# EAGLE design LED Weather Display (EAGLE 9.1.3)
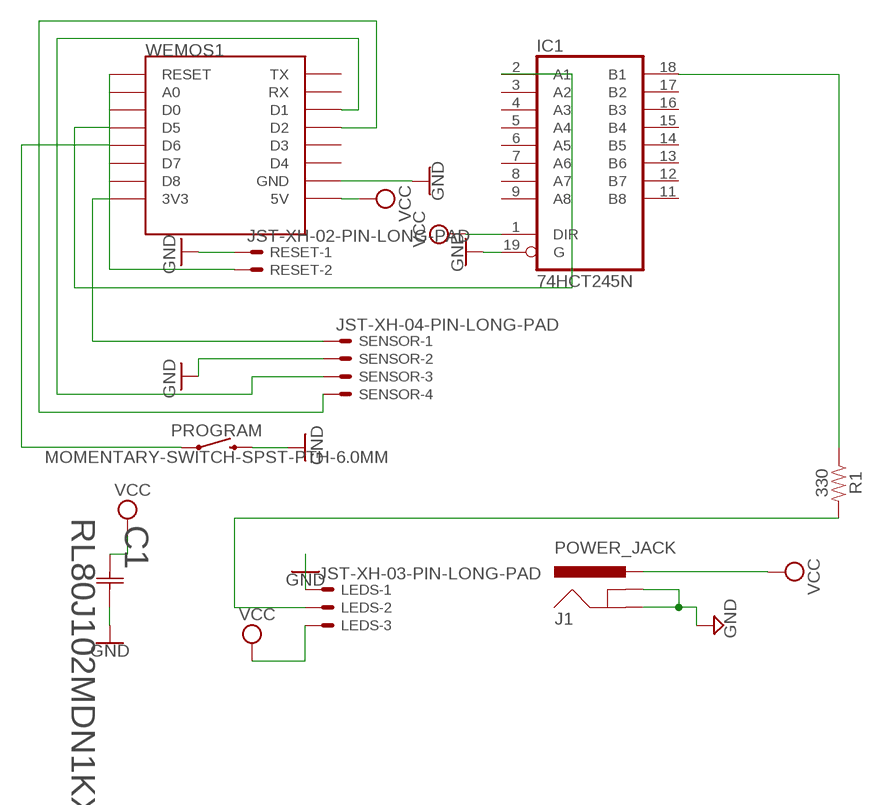
[diagram p0: schematic, sheet 1]

## Parts
C1  RL80J102MDN1KX  [RL8]
IC1  74HCT245N  [DIL20]
J1  POWER_JACK  [POWER_JACK_PTH]
LEDS  JST-XH-03-PIN-LONG-PAD  [JST-XH-03-PACKAGE-LONG-PAD]
PROGRAM  MOMENTARY-SWITCH-SPST-PTH-6.0MM  [TACTILE_SWITCH_PTH_6.0MM]
R1  330  330OHM-HORIZ-1/10W-5%  [AXIAL-0.3]
RESET  JST-XH-02-PIN-LONG-PAD  [JST-XH-02-PACKAGE-LONG-PAD]
SENSOR  JST-XH-04-PIN-LONG-PAD  [JST-XH-04-PACKAGE-LONG-PAD]
WEMOS1  WEMOS-D1-MINI  [WEMOS-D1-MINI]

## Nets
GND: C1.2 IC1.19(G) J1.GND J1.GNDBREAK LEDS.1 PROGRAM.3 RESET.1 SENSOR.2 WEMOS1.GND
N$1: SENSOR.1 WEMOS1.3V3
N$2: LEDS.2 R1.P$2
N$3: IC1.2(A1) WEMOS1.D5
N$4: IC1.18(B1) R1.P$1
N$5: SENSOR.3 WEMOS1.D1
N$6: SENSOR.4 WEMOS1.D2
N$7: PROGRAM.1 WEMOS1.D6
N$8: RESET.2 WEMOS1.RESET
VCC: C1.1 IC1.1(DIR) J1.PWR LEDS.3 WEMOS1.5V
Unconnected: IC1.3(A2) IC1.4(A3) IC1.5(A4) IC1.6(A5) IC1.7(A6) IC1.8(A7) IC1.9(A8) IC1.11(B8) IC1.12(B7) IC1.13(B6) IC1.14(B5) IC1.15(B4) IC1.16(B3) IC1.17(B2) WEMOS1.A0 WEMOS1.D0 WEMOS1.D3 WEMOS1.D4 WEMOS1.D7 WEMOS1.D8 WEMOS1.RX WEMOS1.TX

## Power pins joined to a net without a drawn wire
GND: IC1.10(GND)
VCC: IC1.20(VCC)

## Library data of the parts
C1 = Kyle's Custom:RL80J102MDN1KX: Ceramic Capacitor; MANUFACTURER_PART_NUMBER: RL80J102MDN1KX; VENDOR: Nichicon
IC1 = 74xx-eu:74*245: Octal BUS TRANSCEIVER, 3-state
J1 = SparkFun-Connectors:POWER_JACK: Power Jack Connector This is the standard 5.5mm barrel jack for power. The PTH is the most common, proven, reliable, footprint. The Slot footprint only works if the mill layer is transmitted to the PCB fab house so be warned. Here are the connectors we sell at SparkFun: DC Barrel Power Jack/Connector <https://www.sparkfun.com/products/119> (PRT-00119) DC Barrel Power Jack/Connector (SMD) <https://www.sparkfun.com/products/12748> (PRT-12748) DC Barrel Jack Adapter - Breadboard Compatible <https://www.sparkfun.com/products/10811> (PRT-10811) It is used on this SparkFun product (and many, many others): SparkFun RedBoard - Programmed with Arduino <https://www.sparkfun.com/products/12757> (DEV-12757) Also, if you need a mating power supply or connector, please check these out: Wall Adapter Power Supply - 9VDC 650mA <https://www.sparkfun.com/products/298> (TOL-00298) DC Barrel Jack Adapter - Male <https://www.sparkfun.com/products/10287> (PRT-10287); PROD_ID: CONN-08197
LEDS = Rembrandt Electronics - JST XH Connectors v1-0:JST-XH-03-PIN: JST XH Connector 2 Pin Wire to board connector. Pitch: 2,54 mm, (0.100") Number of pins: 3 Created by Rembrandt Electronics www.rembrandtelectronics.com
PROGRAM = SparkFun-Switches:MOMENTARY-SWITCH-SPST: Momentary Switch (Pushbutton) - SPST Normally-open (NO) SPST momentary switches (buttons, pushbuttons). Variants PTH-12MM - 12mm square, through-hole Momentary Pushbutton Switch - 12mm Square <https://www.sparkfun.com/products/9190> (COM-09190) PTH-6.0MM, PTH-6.0MM-KIT - 6.0mm square, through-hole Mini Pushbutton Switch <https://www.sparkfun.com/products/97> (COM-00097) KIT package intended for soldering kit's - only one side of pads' copper is exposed. PTH-RIGHT-ANGLE-KIT - Right-angle, through-hole Right Angle Tactile Button <https://www.sparkfun.com/products/10791> - Used on SparkFun BigTime Watch Kit <https://www.sparkfun.com/products/11734> SMD-12MM - 12mm square, surface-mount Tactile Button - SMD (12mm) <https://www.sparkfun.com/products/12993> (COM-12993) Used on SparkFun PicoBoard <https://www.sparkfun.com/products/11888> SMD-4.5MM - 4.5mm Square Trackball Switch Used on SparkFun Blackberry Trackballer Breakout <https://www.sparkfun.com/products/13169> SMD-4.6MMX2.8MM - 4.60mm x 2.80mm, surface mount Used on SparkFun SAMD21 Mini Breakout <https://www.sparkfun.com/products/13664> SMD-5.2MM, SMD-5.2-REDUNDANT - 5.2mm square, surface-mount Mini Pushbutton Switch - SMD <https://www.sparkfun.com/products/8720> (COM-08720) Used on Arduino Pro Mini <https://www.sparkfun.com/products/11114> REDUNDANT package connects both switch circuits together SMD-6.0X3.5MM - 6.0 x 3.5mm, surface mount Momentary Reset Switch SMD <https://www.sparkfun.com/products/8229> (COM-08229) SMD-6.2MM-TALL - 6.2mm square, surface mount Tactile Button - SMD (6mm) <https://www.sparkfun.com/products/12992> Used on SparkFun Digital Sandbox <https://www.sparkfun.com/products/12651> SMD-RIGHT-ANGLE - Right-angle, surface mount Used on SparkFun Block for Intel® Edison - Arduino <https://www.sparkfun.com/products/13036>; PROD_ID: SWCH-08441; SF_SKU: COM-00097
R1 = SparkFun-Resistors:330OHM: 330Ω resistor A resistor is a passive two-terminal electrical component that implements electrical resistance as a circuit element. Resistors act to reduce current flow, and, at the same time, act to lower voltage levels within circuits. - Wikipedia; PROD_ID: RES-8371
RESET = Rembrandt Electronics - JST XH Connectors v1-0:JST-XH-02-PIN: JST XH Connector 2 Pin Wire to board connector. Pitch: 2,54 mm, (0.100") Number of pins: 2 Created by Rembrandt Electronics www.rembrandtelectronics.com
SENSOR = Rembrandt Electronics - JST XH Connectors v1-0:JST-XH-04-PIN: JST XH Connector 2 Pin Wire to board connector. Pitch: 2,54 mm, (0.100") Number of pins: 4 Created by Rembrandt Electronics www.rembrandtelectronics.com
WEMOS1 = esp8266modules:WEMOS-D1-MINI: WeMos.cc D1 mini ESP8266 module

## Board
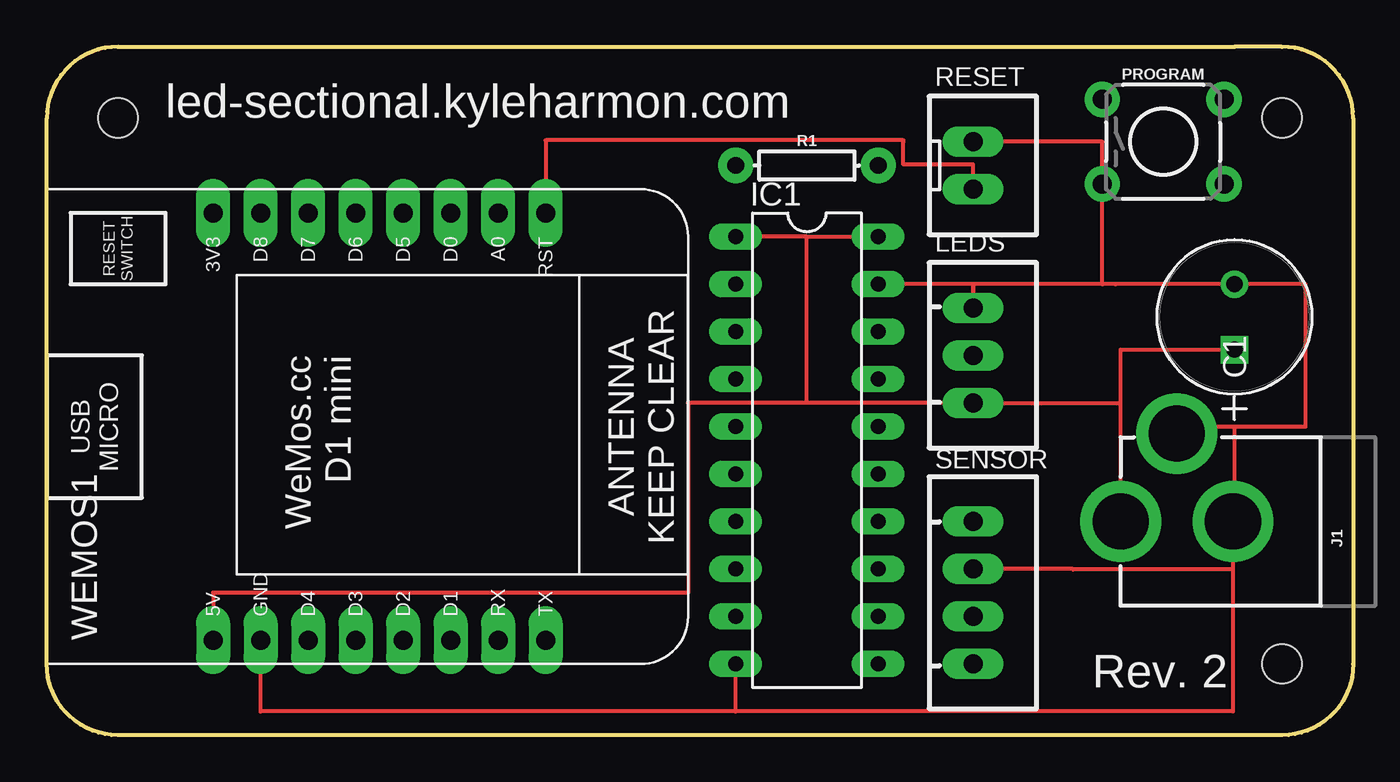
[diagram p1: board, top side]
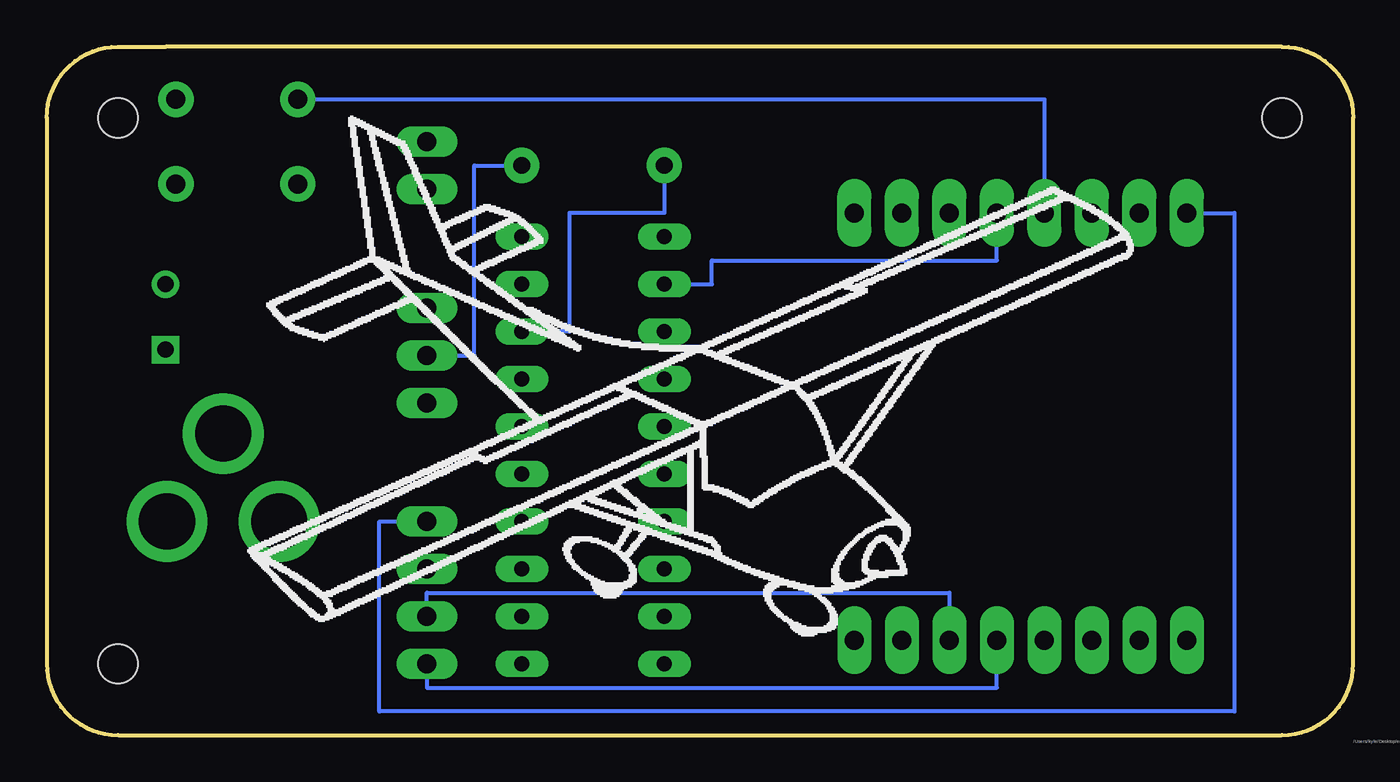
[diagram p2: board, bottom side, seen from below]

Size 69.85 x 36.83 mm. Coordinates in mm from the lower left corner, seen from the top.
Outline: 0,3.81 0,33.02 arc-90 3.81,36.83 63.5,36.83 66.04,36.83 arc-90 69.85,33.02 69.85,3.81 arc-90 66.04,0 3.81,0 arc-90 0,3.81
Copper layers (1*16): Top 0.035mm / dielectric 1.5mm / Bottom 0.035mm
Design rules "SparkFun": minimum track width 8mil, minimum drill 20mil, track to track 8mil, track to pad 8mil, pad to pad 8mil, via to via 8mil, smd to smd 8mil, copper to edge 8mil, drill to drill 8mil, minimum pad ring 12mil, minimum via ring 10mil, stop-mask expansion 4mil, vias tented up to drill 20mil, thermal gap 10mil
Holes 2.1 mm at 66.04,3.81 66.04,33.02 3.81,33.02

### Footprints (pad centres in the part's own frame; a part is rotated, then mirrored left to right if it is on the bottom)
RL8 = drill 0.864 pad 1.372 square: 1 -3.505,0 | drill 0.864 pad 1.372: 2 0,0
DIL20 = drill 0.813 long: 1 -11.43,-3.81; 2 -8.89,-3.81; 3 -6.35,-3.81; 4 -3.81,-3.81; 5 -1.27,-3.81; 6 1.27,-3.81; 7 3.81,-3.81; 8 6.35,-3.81; 9 8.89,-3.81; 10 11.43,-3.81; 11 11.43,3.81; 12 8.89,3.81; 13 6.35,3.81; 14 3.81,3.81; 15 1.27,3.81; 16 -1.27,3.81; 17 -3.81,3.81; 18 -6.35,3.81; 19 -8.89,3.81; 20 -11.43,3.81
POWER_JACK_PTH = drill 2.997 pad 4.318: GND 0,7.7; GNDBREAK 4.7,10.7; PWR 0,13.7
JST-XH-03-PACKAGE-LONG-PAD = drill 1.016 long: 1 -2.54,0; 2 0,0; 3 2.54,0
TACTILE_SWITCH_PTH_6.0MM = drill 1.016 pad 1.88: 1 -3.251,2.261; 2 3.251,2.261; 3 -3.251,-2.261; 4 3.251,-2.261
AXIAL-0.3 = drill 0.9 pad 1.88: P$1 -3.81,0; P$2 3.81,0
JST-XH-02-PACKAGE-LONG-PAD = drill 1.016 long: 1 -1.27,0; 2 1.27,0
JST-XH-04-PACKAGE-LONG-PAD = drill 1.016 long: 1 -3.81,0; 2 -1.27,0; 3 1.27,0; 4 3.81,0
WEMOS-D1-MINI = drill 1.016 pad 1.829 long: 3V3 -10.16,-10.16; 5V 12.7,-10.16; A0 -10.16,5.08; D0 -10.16,2.54; D1 12.7,2.54; D2 12.7,0; D3 12.7,-2.54; D4 12.7,-5.08; D5 -10.16,0; D6 -10.16,-2.54; D7 -10.16,-5.08; D8 -10.16,-7.62; GND 12.7,-7.62; RESET -10.16,7.62; RX 12.7,5.08; TX 12.7,7.62

### Placement (x,y rotation side)
C1  63.5,24.13 90 top
IC1  40.64,15.24 270 top
J1  71.12,11.43 90 top
LEDS  49.53,20.32 270 top
PROGRAM  59.69,31.75 0 top
R1  40.64,30.48 0 top
RESET  49.53,30.48 270 top
SENSOR  49.53,7.62 270 top
WEMOS1  19.05,17.78 270 top

### Tracks (layer width: path | path; a pad name or v marks a point on that pad's centre or on a via)
GND
  Top 0.203: J1.GNDBREAK 60.8,16.51 63.5,16.51 | 63.5,16.51 63.5,11.51 J1.GND 63.42,8.87 | 63.5,16.51 67.31,16.51 67.31,24.13 C1.2 57.15,24.13 | 57.15,24.13 56.44,24.13 PROGRAM.3 56.44,31.75 RESET.1 | 57.15,24.13 49.53,24.13 | 49.53,24.13 LEDS.1 49.53,24.13 | 49.53,24.13 IC1.19 | SENSOR.2 54.85,8.89 54.85,8.87 63.42,8.87 | 63.42,8.87 63.42,1.27 36.83,1.27 | 36.83,1.27 IC1.10 | 36.83,1.27 11.43,1.27 WEMOS1.GND
N$1
  Bottom 0.203: WEMOS1.3V3 6.35,27.94 6.35,1.27 52.07,1.27 52.07,11.43 SENSOR.1
N$2
  Bottom 0.203: LEDS.2 46.99,20.32 46.99,30.48 R1.P$2
N$3
  Bottom 0.203: IC1.2 34.29,24.13 34.29,25.4 19.05,25.4 WEMOS1.D5
N$4
  Bottom 0.203: R1.P$1 36.83,27.94 41.91,27.94 41.91,21.59 IC1.18
N$5
  Bottom 0.203: SENSOR.3 49.53,7.62 21.59,7.62 WEMOS1.D1
N$6
  Bottom 0.203: SENSOR.4 49.53,2.54 19.05,2.54 WEMOS1.D2
N$7
  Bottom 0.203: WEMOS1.D6 16.51,34.01 PROGRAM.1
N$8
  Top 0.203: RESET.2 49.53,30.53 45.8,30.53 45.8,31.75 45.8,31.83 26.67,31.83 WEMOS1.RESET
VCC
  Top 0.203: J1.PWR 57.42,17.78 | 57.42,17.78 57.42,20.62 C1.1 | 57.42,17.78 LEDS.3 40.64,17.78 | 40.64,17.78 40.64,26.67 | 40.64,26.67 IC1.1 | 40.64,26.67 IC1.20 | 40.64,17.78 | 40.64,17.78 34.29,17.78 34.29,7.62 8.89,7.62 WEMOS1.5V

### Text on the board
tPlace: led-sectional.kyleharmon.com | Rev. 2
bPlace: /Users/kyle/Desktop/engine-clipart-plane-engine-2.bmp